# Altium schematic sheet drv8313.schdoc
size 206 x 153 mm
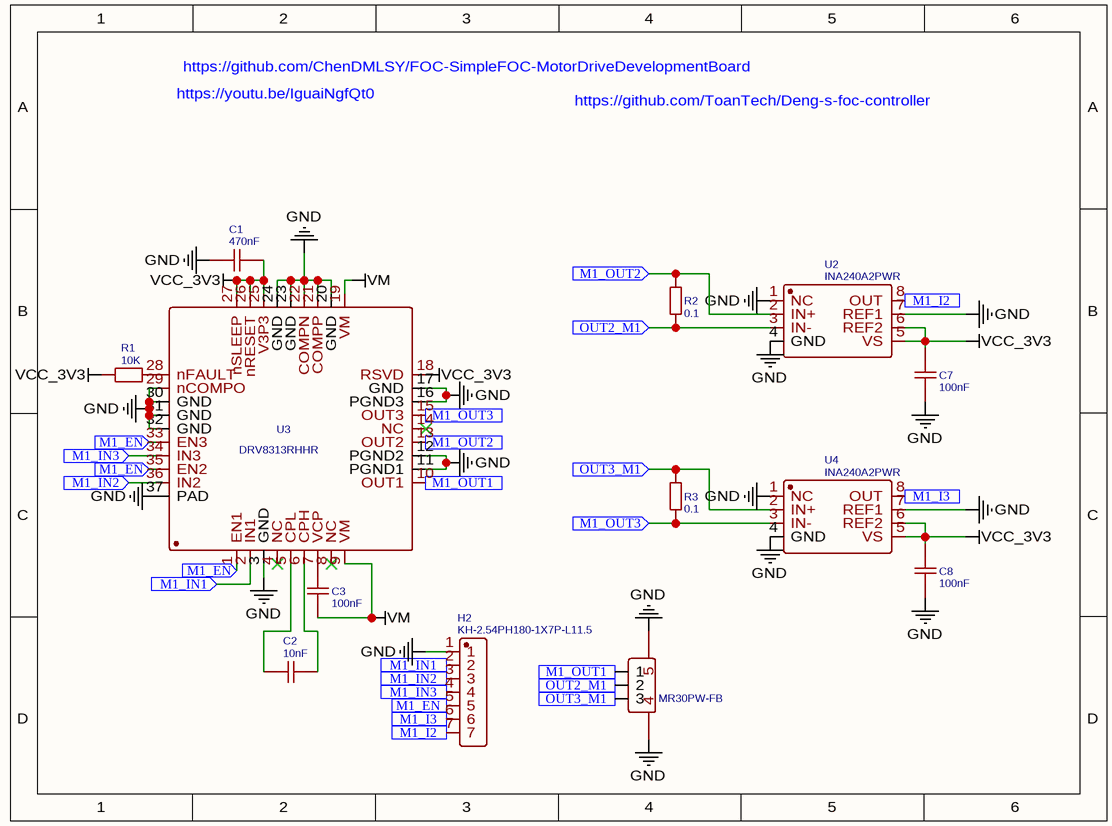
[diagram p0: drv8313.schdoc]

## Parts
C1  470nF  [C0603]
C2  10nF  [C0603]
C3  100nF  [C0603]
C7  100nF  [C0603]
C8  100nF  [C0603]
H2  KH-2.54PH180-1X7P-L11.5  [HDR-TH_7P-P2.54-V-M]
NO  MR30PW-FB  [MR30PW-FB]
R1  10K  [R0603]
R2  0.1  [R1206]
R3  0.1  [R1206]
U2  INA240A2PWR  [TSSOP-8_L4.4-W3.0-P0.65-LS6.4-BL]
U3  DRV8313RHHR  [VQFN-36_L6.0-W6.0-P0.50-TL-EP]
U4  INA240A2PWR  [TSSOP-8_L4.4-W3.0-P0.65-LS6.4-BL]

## Ports
M1_EN (in), M1_I2 (in), M1_I3 (in), M1_IN1 (in), M1_IN2 (in), M1_IN3 (in), M1_OUT1 (in), M1_OUT2 (in), M1_OUT3 (in), OUT2_M1 (in), OUT3_M1 (in)

## Nets
GND: C1.1 C7.2 C8.2 H2.1 NO.4 NO.5 U2.1(NC) U2.4(GND) U2.7(REF1) U3.3(GND) U3.11(PGND1) U3.12(PGND2) U3.16(PGND3) U3.17(GND) U3.20(GND) U3.21(COMPP) U3.22(COMPN) U3.23(GND) U3.24(GND) U3.29(nCOMPO) U3.30(GND) U3.31(GND) U3.32(GND) U3.37(PAD) U4.1(NC) U4.4(GND) U4.7(REF1)
VCC_3V3: C1.2 C7.1 C8.1 R1.2 U2.5(VS) U2.6(REF2) U3.18(RSVD) U3.25(V3P3) U3.26(nRESET) U3.27(nSLEEP) U4.5(VS) U4.6(REF2)
VM: C3.2 U3.9(VM) U3.19(VM)
M1_EN: H2.5 U3.1(EN1) U3.33(EN3) U3.35(EN2) ; port M1_EN
M1_I2: H2.7 U2.8(OUT) ; port M1_I2
M1_I3: H2.6 U4.8(OUT) ; port M1_I3
M1_IN1: H2.2 U3.2(IN1) ; port M1_IN1
M1_IN2: H2.3 U3.36(IN2) ; port M1_IN2
M1_IN3: H2.4 U3.34(IN3) ; port M1_IN3
M1_OUT1: NO.1 U3.10(OUT1) ; port M1_OUT1
M1_OUT2: R2.2 U2.2(IN+) U3.13(OUT2) ; port M1_OUT2
M1_OUT3: R3.1 U3.15(OUT3) U4.3(IN-) ; port M1_OUT3
OUT2_M1: NO.2 R2.1 U2.3(IN-) ; port OUT2_M1
OUT3_M1: NO.3 R3.2 U4.2(IN+) ; port OUT3_M1
NetC2_1: C2.1 U3.6(CPH)
NetC2_2: C2.2 U3.5(CPL)
NetC3_1: C3.1 U3.7(VCP)
NetR1_1: R1.1 U3.28(nFAULT)

Not connected (* = marked no-connect by the designer): U3 4(NC)* 8(NC)* 14(NC)*

## Notes on the sheet
- https://youtu.be/IguaiNgfQt0
- https://github.com/ChenDMLSY/FOC-SimpleFOC-MotorDriveDevelopmentBoard
- https://github.com/ToanTech/Deng-s-foc-controller

## Library data of the parts
C1 = 470nF: BOM_Manufacturer: YAGEO; BOM_Manufacturer Part: CC0603KRX5R6BB474; nameAlias: Capacitance; Contributor: LCSC; BOM_Supplier: LCSC; BOM_Supplier Part: C576840; BOM_JLCPCB Part Class: Extended Part; spicePre: C; spiceSymbolName: CC0603KRX5R6BB474
C2 = 10nF: BOM_Manufacturer: YAGEO; BOM_Manufacturer Part: CC0603JRX7R7BB103; nameAlias: Capacitance; Contributor: LCSC; BOM_Supplier: LCSC; BOM_Supplier Part: C519509; BOM_JLCPCB Part Class: Extended Part; spicePre: C; spiceSymbolName: CC0603JRX7R7BB103
C3 C7 C8 = 100nF: BOM_Manufacturer: YAGEO; BOM_Manufacturer Part: AC0603KRX7R9BB104; nameAlias: Capacitance; Contributor: LCSC; BOM_Supplier: LCSC; BOM_Supplier Part: C149620; BOM_JLCPCB Part Class: Extended Part; spicePre: C; spiceSymbolName: AC0603KRX7R9BB104
H2 = KH-2.54PH180-1X7P-L11.5: BOM_Manufacturer: kinghelm(金航标); Contributor: LCSC; BOM_Supplier: LCSC; BOM_Supplier Part: C2932700; BOM_Manufacturer Part: KH-2.54PH180-1X7P-L11.5; BOM_JLCPCB Part Class: Extended Part; spicePre: H; spiceSymbolName: KH-2.54PH180-1X7P-L11.5
NO = MR30PW-FB: BOM_Manufacturer: Amass; BOM_Supplier: AMASS; BOM_Manufacturer Part: MR30PW-FB; BOM_Supplier Part: MR30PW-FB; spicePre: P; spiceSymbolName: MR30PW-FB
R1 = 10K: BOM_Manufacturer: ResistorToday; BOM_Manufacturer Part: PTFR0603D10K0P9; nameAlias: Resistance (Ohms); Contributor: LCSC; BOM_Supplier: LCSC; BOM_Supplier Part: C375971; spicePre: R; spiceSymbolName: PTFR0603D10K0P9
R2 R3 = 0.1: BOM_Manufacturer: RALEC; BOM_Manufacturer Part: LR1206-21R010F4; nameAlias: Resistance (Ohms); Contributor: LCSC; BOM_Supplier: LCSC; BOM_Supplier Part: C154635; BOM_JLCPCB Part Class: Extended Part; spicePre: R; spiceSymbolName: LR1206-21R010F4
U2 U4 = INA240A2PWR: BOM_Manufacturer: TI; subpart_no: 1; Contributor: LCSC; BOM_Supplier: LCSC; BOM_Manufacturer Part: INA240A2PWR; BOM_Supplier Part: C129949; BOM_JLCPCB Part Class: Extended Part; spicePre: U; spiceSymbolName: INA240A2PWR
U3 = DRV8313RHHR: BOM_Manufacturer: TI; Contributor: LCSC; BOM_Supplier: LCSC; BOM_Manufacturer Part: DRV8313RHHR; BOM_Supplier Part: C165154; BOM_JLCPCB Part Class: Extended Part; spicePre: U; spiceSymbolName: DRV8313RHHR